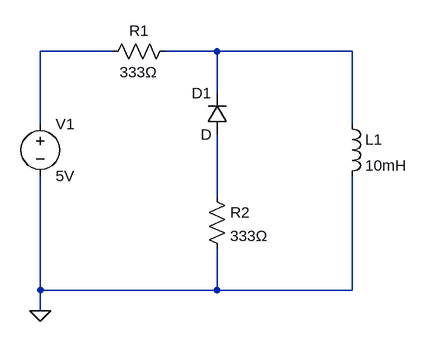
[diagram p0: schematic ex4.asc]
ex4.asc, the LTspice schematic file:
Version 4
SHEET 1 880 680
WIRE 112 -64 0 -64
WIRE 272 -64 192 -64
WIRE 480 -64 272 -64
WIRE 272 0 272 -64
WIRE 0 48 0 -64
WIRE 480 48 480 -64
WIRE 272 160 272 64
WIRE 0 304 0 128
WIRE 272 304 272 240
WIRE 272 304 0 304
WIRE 480 304 480 128
WIRE 480 304 272 304
WIRE 0 336 0 304
FLAG 0 336 0
SYMBOL voltage 0 32 R0
WINDOW 123 0 0 Left 0
WINDOW 39 0 0 Left 0
SYMATTR InstName V1
SYMATTR Value 5V
SYMBOL res 208 -80 R90
WINDOW 0 0 56 VBottom 2
WINDOW 3 32 56 VTop 2
SYMATTR InstName R1
SYMATTR Value 333Ω
SYMBOL res 256 144 R0
SYMATTR InstName R2
SYMATTR Value 333Ω
SYMBOL diode 288 64 R180
WINDOW 0 24 64 Left 2
WINDOW 3 24 0 Left 2
SYMATTR InstName D1
SYMBOL ind 464 32 R0
SYMATTR InstName L1
SYMATTR Value 10mH

The netlist it stands for:
* ex4.asc
V1 N001 0 5V
R1 N002 N001 333Ω
R2 N003 0 333Ω
D1 N003 N002 D
L1 N002 0 10mH
.model D D
.lib standard.dio
.backanno
.end